# EAGLE design untitled (EAGLE 9.6.2)
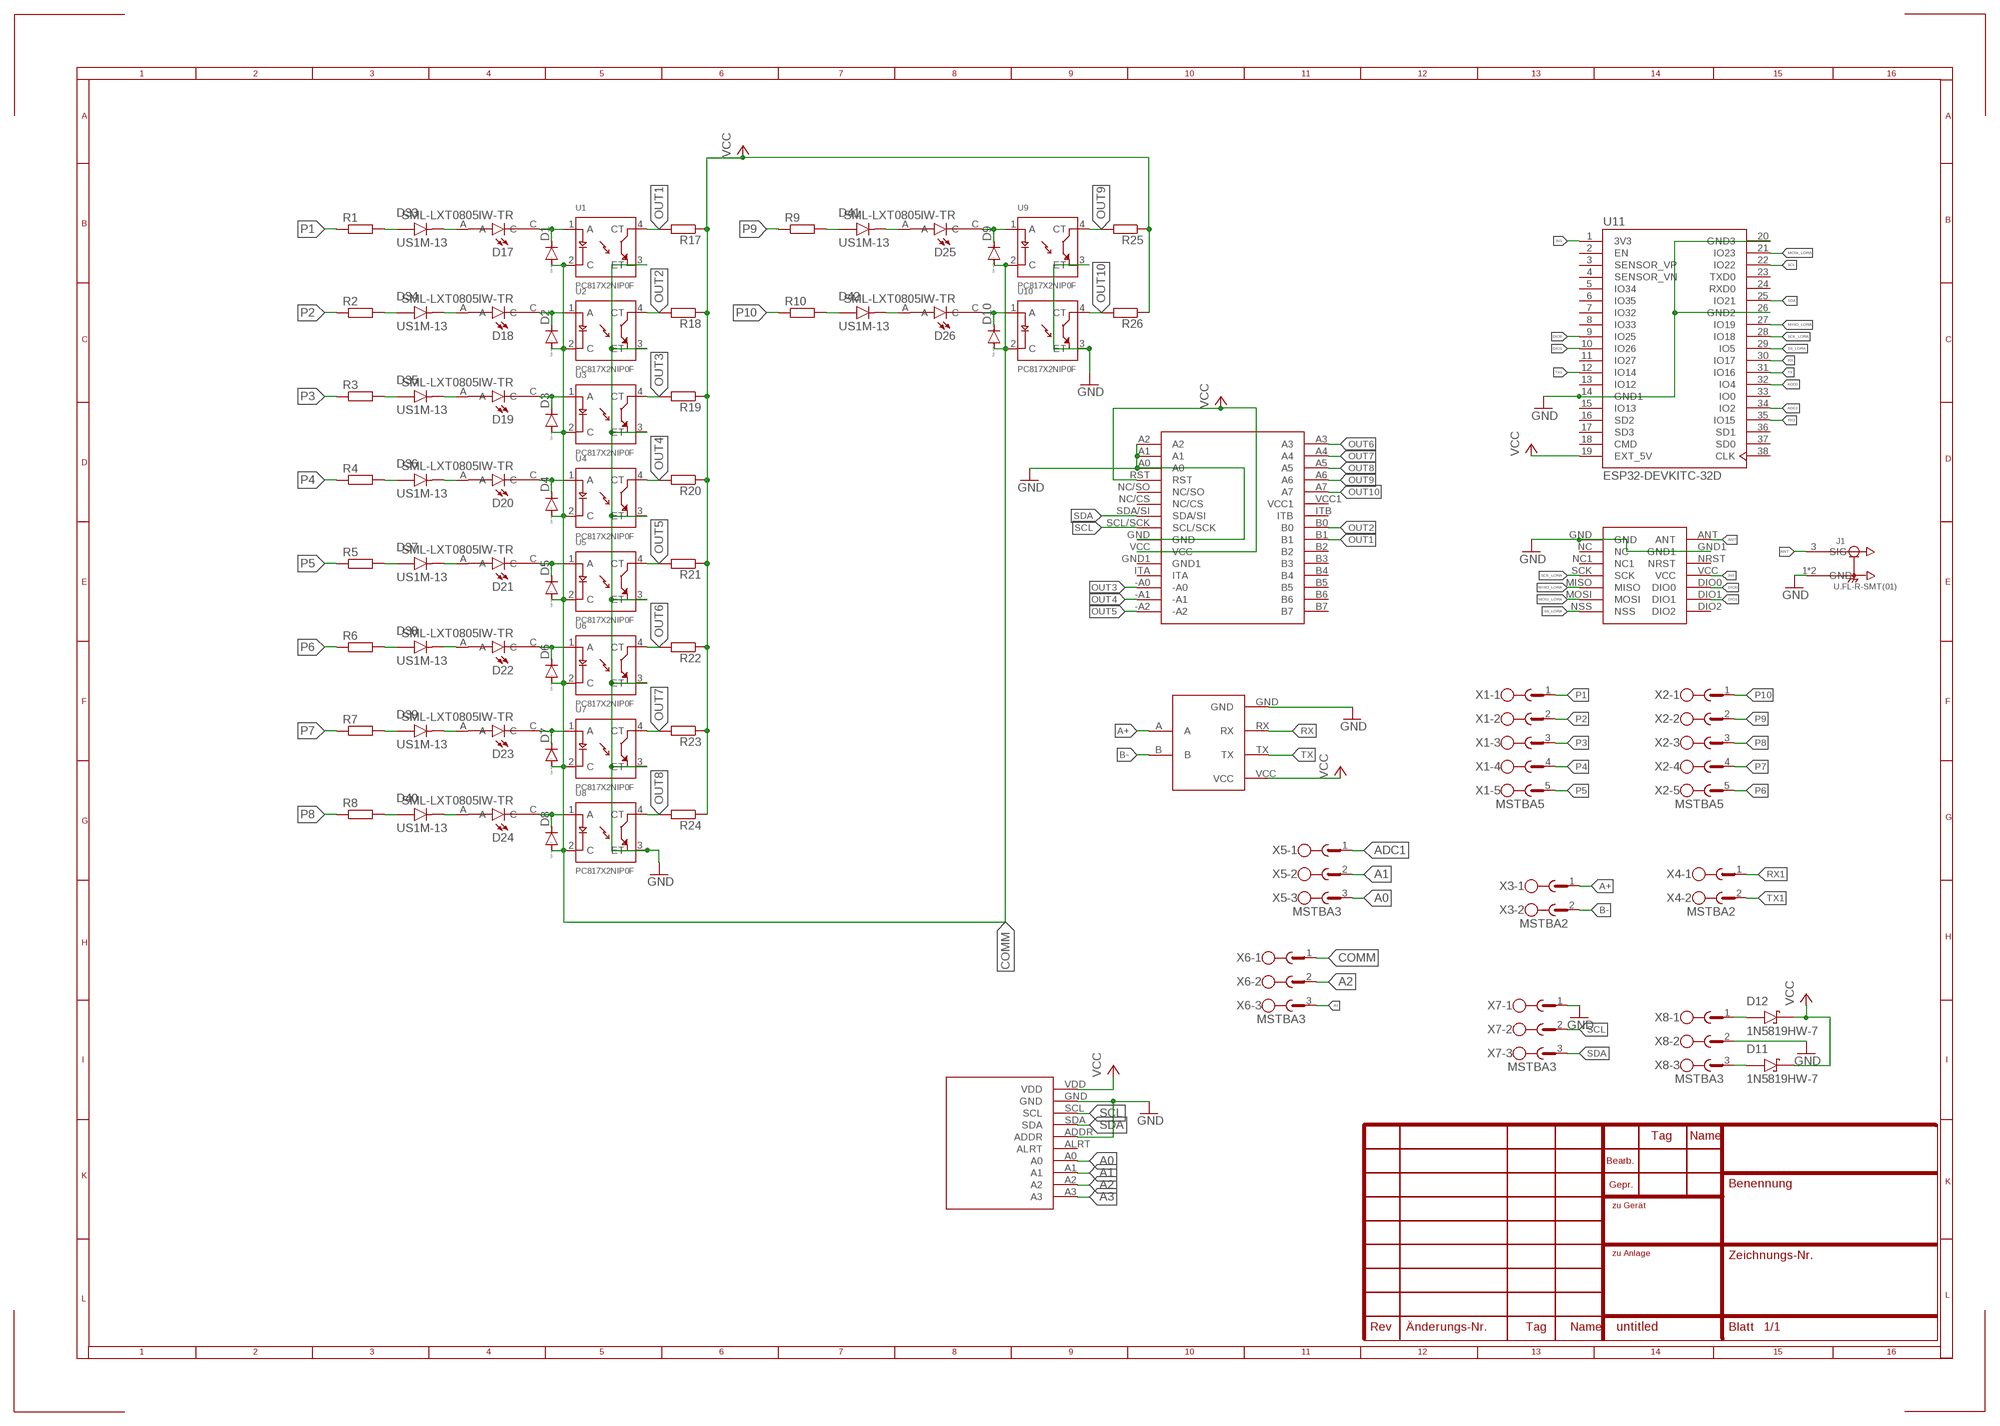
[diagram p0: schematic, sheet 1]

## Parts
ADS1  ADS1115  [ADS1115]
D1  DIODE-SOD123  [SOD123]
D2  DIODE-SOD123  [SOD123]
D3  DIODE-SOD123  [SOD123]
D4  DIODE-SOD123  [SOD123]
D5  DIODE-SOD123  [SOD123]
D6  DIODE-SOD123  [SOD123]
D7  DIODE-SOD123  [SOD123]
D8  DIODE-SOD123  [SOD123]
D9  DIODE-SOD123  [SOD123]
D10  DIODE-SOD123  [SOD123]
D11  1N5819HW-7  [SOD3715X145N]
D12  1N5819HW-7  [SOD3715X145N]
D17  SML-LXT0805IW-TR  [LEDC2012X120N]
D18  SML-LXT0805IW-TR  [LEDC2012X120N]
D19  SML-LXT0805IW-TR  [LEDC2012X120N]
D20  SML-LXT0805IW-TR  [LEDC2012X120N]
D21  SML-LXT0805IW-TR  [LEDC2012X120N]
D22  SML-LXT0805IW-TR  [LEDC2012X120N]
D23  SML-LXT0805IW-TR  [LEDC2012X120N]
D24  SML-LXT0805IW-TR  [LEDC2012X120N]
D25  SML-LXT0805IW-TR  [LEDC2012X120N]
D26  SML-LXT0805IW-TR  [LEDC2012X120N]
D33  US1M-13  [DIOM5226X240N]
D34  US1M-13  [DIOM5226X240N]
D35  US1M-13  [DIOM5226X240N]
D36  US1M-13  [DIOM5226X240N]
D37  US1M-13  [DIOM5226X240N]
D38  US1M-13  [DIOM5226X240N]
D39  US1M-13  [DIOM5226X240N]
D40  US1M-13  [DIOM5226X240N]
D41  US1M-13  [DIOM5226X240N]
D42  US1M-13  [DIOM5226X240N]
J1  U.FL-R-SMT(01)  [HRS_U.FL-R-SMT(01)]
LORA-NICERF-V1  LORA-NICERF-V2  [LORA-NICERF-V2]
MCP1  MCP23017  [MCP23017]
R1  R-EU_0414/15  [0414/15]
R2  R-EU_0414/15  [0414/15]
R3  R-EU_0414/15  [0414/15]
R4  R-EU_0414/15  [0414/15]
R5  R-EU_0414/15  [0414/15]
R6  R-EU_0414/15  [0414/15]
R7  R-EU_0414/15  [0414/15]
R8  R-EU_0414/15  [0414/15]
R9  R-EU_0414/15  [0414/15]
R10  R-EU_0414/15  [0414/15]
R17  R-EU_R0805  [R0805]
R18  R-EU_R0805  [R0805]
R19  R-EU_R0805  [R0805]
R20  R-EU_R0805  [R0805]
R21  R-EU_R0805  [R0805]
R22  R-EU_R0805  [R0805]
R23  R-EU_R0805  [R0805]
R24  R-EU_R0805  [R0805]
R25  R-EU_R0805  [R0805]
R26  R-EU_R0805  [R0805]
TTL-RS1  TTL-RS485  [TTL-RS485]
U1  PC817X2NIP0F  [SOT254P975X400-4N]
U2  PC817X2NIP0F  [SOT254P975X400-4N]
U3  PC817X2NIP0F  [SOT254P975X400-4N]
U4  PC817X2NIP0F  [SOT254P975X400-4N]
U5  PC817X2NIP0F  [SOT254P975X400-4N]
U6  PC817X2NIP0F  [SOT254P975X400-4N]
U7  PC817X2NIP0F  [SOT254P975X400-4N]
U8  PC817X2NIP0F  [SOT254P975X400-4N]
U9  PC817X2NIP0F  [SOT254P975X400-4N]
U10  PC817X2NIP0F  [SOT254P975X400-4N]
U11  ESP32-DEVKITC-32D  [MODULE_ESP32-DEVKITC-32D]
X1  MSTBA5  [MSTBA5]
X2  MSTBA5  [MSTBA5]
X3  MSTBA2  [MSTBA2]
X4  MSTBA2  [MSTBA2]
X5  MSTBA3  [MSTBA3]
X6  MSTBA3  [MSTBA3]
X7  MSTBA3  [MSTBA3]
X8  MSTBA3  [MSTBA3]

## Nets
3V3: LORA-NICERF-V1.VCC U11.1(3V3)
A0: ADS1.A0 X5.3
A1: ADS1.A1 X5.2
A2: ADS1.A2 X6.2
A3: ADS1.A3 X6.3
A+: TTL-RS1.A X3.1
ADC0: U11.32(IO4)
ADC1: U11.34(IO2) X5.1
ANT: J1.3(SIG) LORA-NICERF-V1.ANT
B-: TTL-RS1.B X3.2
COMM: D1.A D2.A D3.A D4.A D5.A D6.A D7.A D8.A D9.A D10.A U1.2(C) U2.2(C) U3.2(C) U4.2(C) U5.2(C) U6.2(C) U7.2(C) U8.2(C) U9.2(C) U10.2(C) X6.1
DIO0: LORA-NICERF-V1.DIO0 U11.9(IO25)
DIO1: LORA-NICERF-V1.DIO1 U11.10(IO26)
GND: ADS1.ADDR ADS1.GND J1.1(GND) J1.2(GND) LORA-NICERF-V1.GND LORA-NICERF-V1.GND1 MCP1.A0 MCP1.A1 MCP1.A2 MCP1.GND TTL-RS1.GND U1.3(ET) U2.3(ET) U3.3(ET) U4.3(ET) U5.3(ET) U6.3(ET) U7.3(ET) U8.3(ET) U9.3(ET) U10.3(ET) U11.14(GND1) U11.20(GND3) U11.26(GND2) X7.1 X8.2
MISO_LORA: LORA-NICERF-V1.MISO U11.27(IO19)
MOSI_LORA: LORA-NICERF-V1.MOSI U11.21(IO23)
N$1: D17.A D33.C(K)
N$2: D33.A R1.2
N$3: D1.C D17.C U1.1(A)
N$5: D34.A R2.2
N$6: D18.A D34.C(K)
N$7: D2.C D18.C U2.1(A)
N$8: D35.A R3.2
N$9: D19.A D35.C(K)
N$10: D3.C D19.C U3.1(A)
N$11: D36.A R4.2
N$12: D20.A D36.C(K)
N$13: D4.C D20.C U4.1(A)
N$15: D12.A X8.1
N$16: D11.A X8.3
N$17: D37.A R5.2
N$18: D21.A D37.C(K)
N$19: D5.C D21.C U5.1(A)
N$20: D38.A R6.2
N$21: D22.A D38.C(K)
N$22: D6.C D22.C U6.1(A)
N$25: D39.A R7.2
N$26: D23.A D39.C(K)
N$27: D7.C D23.C U7.1(A)
N$28: D40.A R8.2
N$29: D24.A D40.C(K)
N$30: D8.C D24.C U8.1(A)
N$33: D41.A R9.2
N$34: D25.A D41.C(K)
N$35: D9.C D25.C U9.1(A)
N$36: D42.A R10.2
N$37: D26.A D42.C(K)
N$38: D10.C D26.C U10.1(A)
OUT1: MCP1.B1 R17.2 U1.4(CT)
OUT2: MCP1.B0 R18.2 U2.4(CT)
OUT3: MCP1.-A0 R19.2 U3.4(CT)
OUT4: MCP1.-A1 R20.2 U4.4(CT)
OUT5: MCP1.-A2 R21.2 U5.4(CT)
OUT6: MCP1.A3 R22.2 U6.4(CT)
OUT7: MCP1.A4 R23.2 U7.4(CT)
OUT8: MCP1.A5 R24.2 U8.4(CT)
OUT9: MCP1.A6 R25.2 U9.4(CT)
OUT10: MCP1.A7 R26.2 U10.4(CT)
P1: R1.1 X1.1
P2: R2.1 X1.2
P3: R3.1 X1.3
P4: R4.1 X1.4
P5: R5.1 X1.5
P6: R6.1 X2.5
P7: R7.1 X2.4
P8: R8.1 X2.3
P9: R9.1 X2.2
P10: R10.1 X2.1
RX: TTL-RS1.RX U11.30(IO17)
RX1: U11.35(IO15) X4.1
SCK_LORA: LORA-NICERF-V1.SCK U11.28(IO18)
SCL: ADS1.SCL MCP1.SCL/SCK U11.22(IO22) X7.2
SDA: ADS1.SDA MCP1.SDA/SI U11.25(IO21) X7.3
SS_LORA: LORA-NICERF-V1.NSS U11.29(IO5)
TX: TTL-RS1.TX U11.31(IO16)
TX1: U11.12(IO14) X4.2
VCC: ADS1.VDD D11.C(K) D12.C(K) MCP1.RST MCP1.VCC R17.1 R18.1 R19.1 R20.1 R21.1 R22.1 R23.1 R24.1 R25.1 R26.1 TTL-RS1.VCC U11.19(EXT_5V)
Unconnected: ADS1.ALRT LORA-NICERF-V1.DIO2 LORA-NICERF-V1.NC LORA-NICERF-V1.NC1 LORA-NICERF-V1.NRST MCP1.B2 MCP1.B3 MCP1.B4 MCP1.B5 MCP1.B6 MCP1.B7 MCP1.GND1 MCP1.ITA MCP1.ITB MCP1.NC/CS MCP1.NC/SO MCP1.VCC1 U11.2(EN) U11.3(SENSOR_VP) U11.4(SENSOR_VN) U11.5(IO34) U11.6(IO35) U11.7(IO32) U11.8(IO33) U11.11(IO27) U11.13(IO12) U11.15(IO13) U11.16(SD2) U11.17(SD3) U11.18(CMD) U11.23(TXD0) U11.24(RXD0) U11.33(IO0) U11.36(SD1) U11.37(SD0) U11.38(CLK)

## Library data of the parts
ADS1 = ds1115:ADS1115
D1-D10 = diode:DIODE-: DIODE
D11 D12 = 1N5819HW-7:1N5819HW-7: 1N5819HW Series 40 V 1 A Surface Mount Schottky Barrier Rectifier - SOD-123 Check availability <https://pricing.snapeda.com/parts/1N5819HW-7/Diodes%20Inc./view-part?ref=eda>; AVAILABILITY: In Stock; DESCRIPTION: Diode Schottky 40 V 1A Surface Mount SOD-123; MF: Diodes Inc.; MP: 1N5819HW-7; PACKAGE: SOD-123 Fairchild Semiconductor; PRICE: None; PURCHASE-URL: https://pricing.snapeda.com/search/part/1N5819HW-7/?ref=eda
D17-D26 = SML-LXT0805IW-TR:SML-LXT0805IW-TR: LED; Luminous Intensity:11µcd; Viewing Angle:140°; Forward Current:30mA; Forward Voltage:2V; Color:Red; LED Color:Red; Leaded Process Compatible:Yes; Lens Color:White; Mounting Type:Surface Mount ;RoHS Compliant: Yes Check availability <https://pricing.snapeda.com/parts/SML-LXT0805IW-TR/Lumex%20Opto/Components/view-part?ref=eda>; AVAILABILITY: In Stock; DESCRIPTION: Red - LED Indication - Discrete 2V 0805 (2012 Metric); MF: Lumex Opto/Components; MP: SML-LXT0805IW-TR; PACKAGE: 0805 Lumex; PRICE: None; PURCHASE-URL: https://pricing.snapeda.com/search/part/SML-LXT0805IW-TR/?ref=eda
D33-D42 = US1M-13:US1M-13: Diode, Fast Recovery, 1a, 1kv, Do-214ac-2, Full Reel Check availability <https://pricing.snapeda.com/parts/US1M-13/Diodes%20Incorporated/view-part?ref=eda>; AVAILABILITY: In Stock; DESCRIPTION: Diode Standard 1000 V 1A Surface Mount SMA; MF: Diodes Incorporated; MP: US1M-13; PACKAGE: DO-214AC-214 Diodes Incorporated; PRICE: None; PURCHASE-URL: https://pricing.snapeda.com/search/part/US1M-13/?ref=eda
J1 = U.FL-R-SMT_01_:U.FL-R-SMT(01): U.FL Series 6 Ghz 50 Ohm Ultra-small SMT Coaxial Cable Receptacle Check availability <https://pricing.snapeda.com/parts/U.FL-R-SMT%2801%29/Hirose/view-part?ref=eda>; AVAILABILITY: In Stock; DESCRIPTION: U.FL (UMCC) Connector Receptacle, Male Pin 50Ohm Surface Mount Solder. RF Connectors / Coaxial Connectors; MF: Hirose; MP: U.FL-R-SMT(01); PACKAGE: None; PRICE: None; PURCHASE-URL: https://pricing.snapeda.com/search/part/U.FL-R-SMT(01)/?ref=eda
LORA-NICERF-V1 = LORA-NICERF-V2:LORA-NICERF-V2
MCP1 = mcp23017:MCP23017
R1-R10 R17-R26 = rcl:R-EU_: RESISTOR, European symbol; SPICEPREFIX: R
TTL-RS1 = TTL-RS485:TTL-RS485
U1-U10 = PC817X2NIP0F:PC817X2NIP0F: PC817 Series 1 Channel 80 V 5000 Vrms General Purpose Photocoupler - DIP-4 Check availability <https://pricing.snapeda.com/parts/PC817X2NIP0F/Sharp%20Microelectronics/view-part?ref=eda>; AVAILABILITY: Not in stock; DESCRIPTION: Optoisolator Transistor Output 5000Vrms 1 Channel 4-SMD; MF: Sharp Microelectronics; MP: PC817X2NIP0F; PACKAGE: SMD-4 Sharp Microelectronics; PRICE: None
U11 = ESP32-DEVKITC-32D:ESP32-DEVKITC-32D: Eval Board For Esp-Wroom-32 Check availability <https://pricing.snapeda.com/parts/ESP32-DEVKITC-32D/Espressif%20Systems/view-part?ref=eda>; AVAILABILITY: In Stock; DESCRIPTION: WiFi Development Tools (802.11) ESP32 General Development Kit, ESP32-WROOM-32D on the board; MF: Espressif Systems; MP: ESP32-DEVKITC-32D; PACKAGE: None; PRICE: None; PURCHASE-URL: https://pricing.snapeda.com/search/part/ESP32-DEVKITC-32D/?ref=eda
X1 X2 = con-phoenix-508:MSTBA5: PHOENIX; MPN: 1757271; OC_FARNELL: 3705201; OC_NEWARK: 71C4164
X3 X4 = con-phoenix-508:MSTBA2: PHOENIX; MF: FARNELL; MPN: 1757242; OC_FARNELL: 3705171; OC_NEWARK: 71C4161
X5-X8 = con-phoenix-508:MSTBA3: PHOENIX; MF: FARNELL; MPN: 1757255; OC_FARNELL: 3705183; OC_NEWARK: 71C4162

## Board
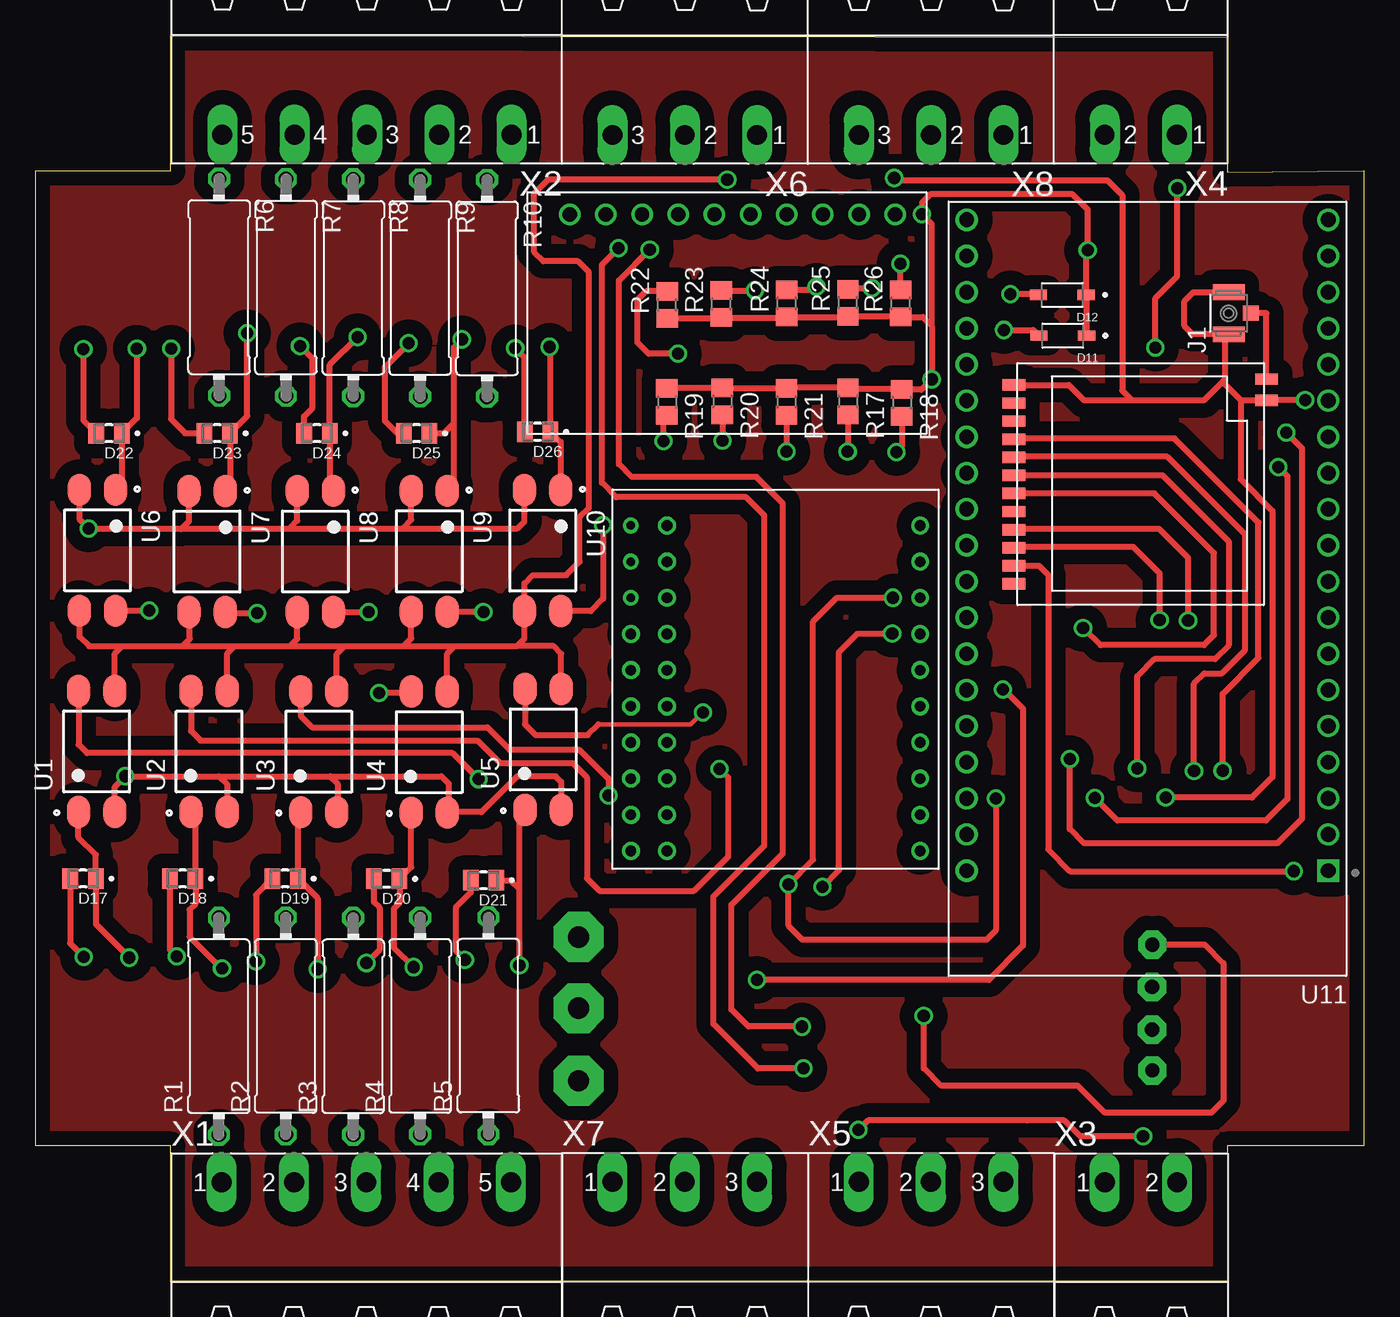
[diagram p1: board, top side]
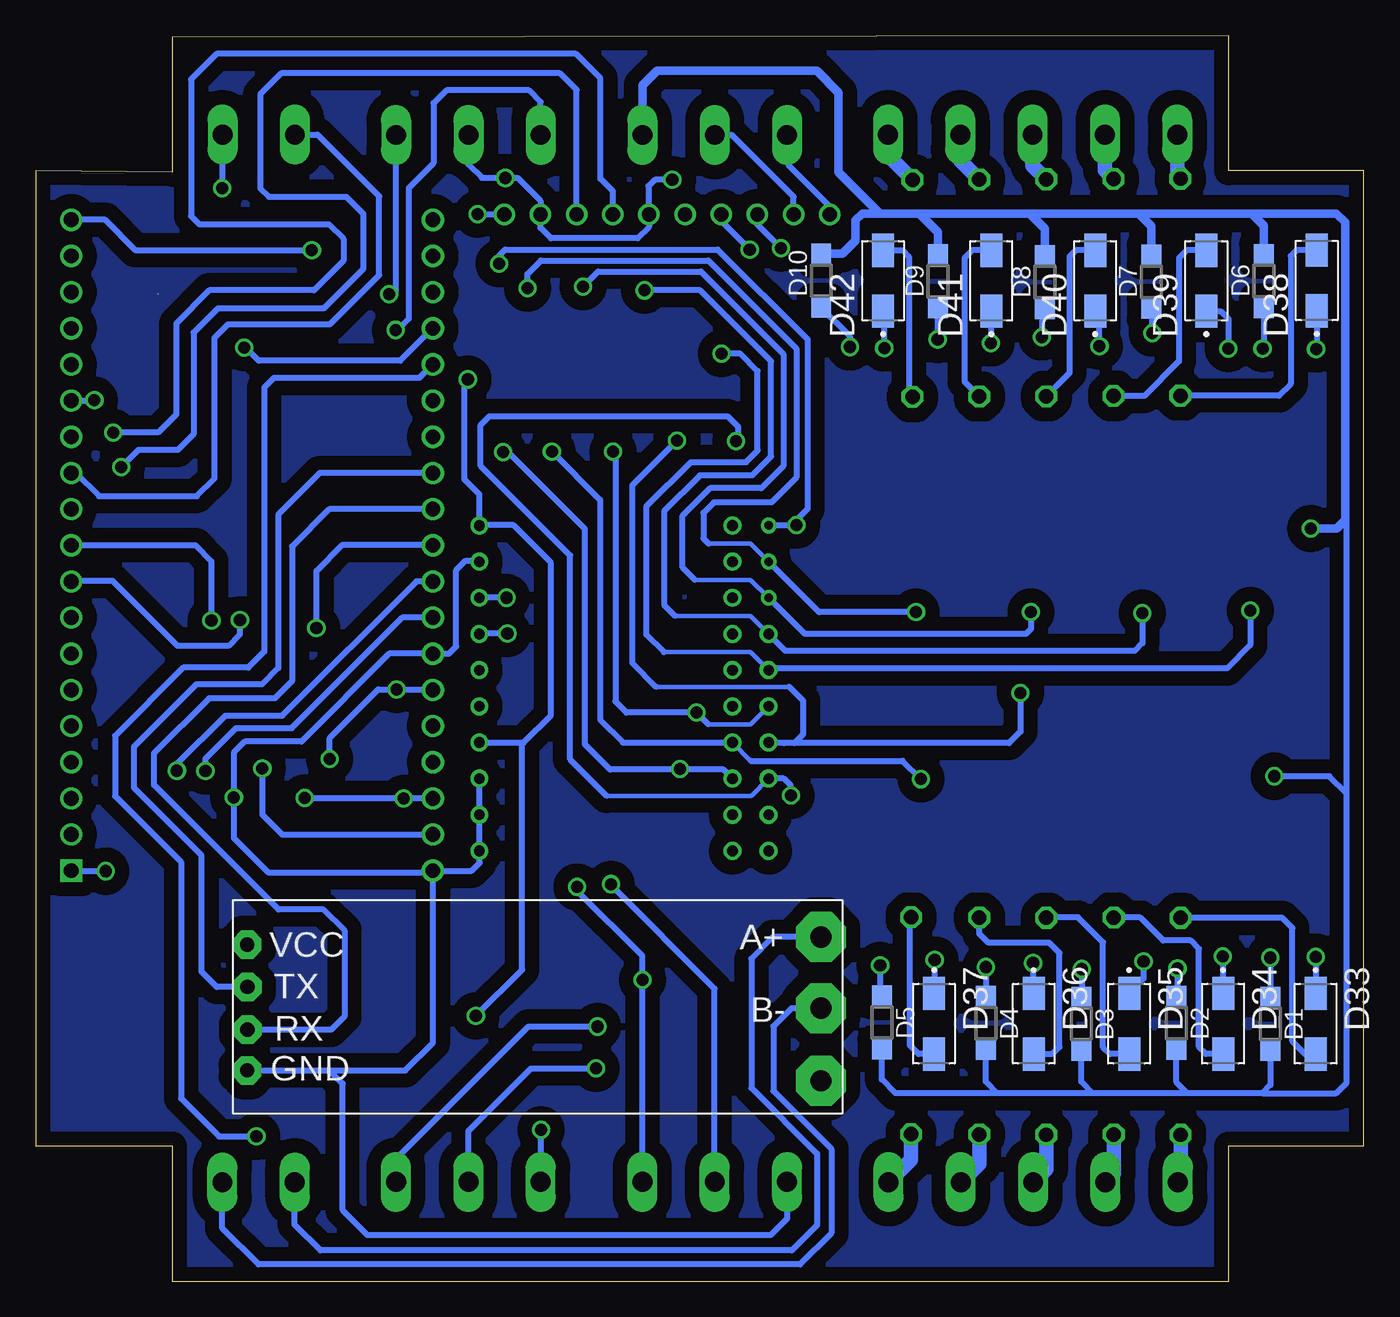
[diagram p2: board, bottom side, seen from below]

Size 93.3 x 87.5 mm. Coordinates in mm from the lower left corner, seen from the top.
Outline: 9.5,87.5 83.7,87.4 83.7,77.9 93.3,78 93.3,9.5 83.7,9.5 83.7,0 9.5,0 9.5,9.5 0,9.5 0,78 9.5,78 9.5,87.5
Copper layers (1*16): Top 0.035mm / dielectric 1.5mm / Bottom 0.035mm
Design rules "default": minimum track width 6mil, minimum drill 0.35mm, track to track 6mil, track to pad 6mil, pad to pad 6mil, via to via 6mil, smd to smd 6mil, copper to edge 40mil, drill to drill 6mil, minimum pad ring 10mil, minimum via ring 8mil, stop-mask expansion 4mil, vias tented up to drill 0mil, thermal gap 10mil

### Footprints (pad centres in the part's own frame; a part is rotated, then mirrored left to right if it is on the bottom)
ADS1115 = drill 1: A0 -6.35,-1.27; A1 -6.35,-3.81; A2 -6.35,-6.35; A3 -6.35,-8.89; ADDR -6.35,3.81; ALRT -6.35,1.27; GND -6.35,11.43; SCL -6.35,8.89; SDA -6.35,6.35; VDD -6.35,13.97
SOD123 = smd 1.4 x 1.4: A 1.9,0; C -1.9,0
SOD3715X145N = smd 1.21 x 0.73: A 1.68,0; C -1.68,0
LEDC2012X120N = smd 1.1 x 1.45: A 0.9,0; C -0.9,0
DIOM5226X240N = smd 2.33 x 1.55: A 2.135,0; C -2.135,0
HRS_U.FL-R-SMT(01) = smd 1.1 x 2.25: 1 -1.475,0; 2 1.475,0 | smd 1.05 x 1.1: 3 0,-1.55
LORA-NICERF-V2 = smd 1.6 x 0.8: ANT 9.17,6.81; DIO0 -8.57,-5.03; DIO1 -8.57,-3.76; DIO2 -8.57,-2.49; GND -8.57,6.4; GND1 9.17,5.31; MISO -8.57,1.32; MOSI -8.57,0.05; NC -8.57,5.13; NC1 -8.57,3.86; NRST -8.57,-7.57; NSS -8.57,-1.22; SCK -8.57,2.59; VCC -8.57,-6.3
MCP23017 = drill 0.75: -A0 11.43,6.35; -A1 11.43,3.81; -A2 11.43,1.27; A0 -8.89,6.35; A1 -8.89,8.89; A2 -8.89,11.43; A3 11.43,-1.27; A4 11.43,-3.81; B0 8.89,6.35; B1 8.89,3.81; B2 8.89,1.27; B3 8.89,-1.27; B4 8.89,-3.81; B5 8.89,-6.35; B6 8.89,-8.89; B7 8.89,-11.43; GND -8.89,-8.89; GND1 11.43,11.43; ITA 11.43,8.89; ITB 8.89,8.89; NC/CS -8.89,-1.27; NC/SO -8.89,1.27; RST -8.89,3.81; SCL/SCK -8.89,-6.35; SDA/SI -8.89,-3.81; VCC -8.89,-11.43; VCC1 8.89,11.43 | drill 0.6: A5 11.43,-6.35; A6 11.43,-8.89; A7 11.43,-11.43
0414/15 = drill 1.016 octagon: 1 -7.62,0; 2 7.62,0
R0805 = smd 1.3 x 1.5: 1 -0.95,0; 2 0.95,0
TTL-RS485 = drill 1.5 pad 3.5 octagon: A -19.7,-6; B -19.7,-1; P$7 -19.7,4.1 | drill 1 pad 2 octagon: GND 20.6,3.37; RX 20.581,0.505; TX 20.583,-2.493; VCC 20.6,-5.47
SOT254P975X400-4N = smd 2.25 x 1.6: 1 -4.25,1.27; 2 -4.25,-1.27; 3 4.25,-1.27; 4 4.25,1.27
MODULE_ESP32-DEVKITC-32D = drill 1.04 square: 1 -12.7,19.76 | drill 1.04: 2 -12.7,17.22; 3 -12.7,14.68; 4 -12.7,12.14; 5 -12.7,9.6; 6 -12.7,7.06; 7 -12.7,4.52; 8 -12.7,1.98; 9 -12.7,-0.56; 10 -12.7,-3.1; 11 -12.7,-5.64; 12 -12.7,-8.18; 13 -12.7,-10.72; 14 -12.7,-13.26; 15 -12.7,-15.8; 16 -12.7,-18.34; 17 -12.7,-20.88; 18 -12.7,-23.42; 19 -12.7,-25.96; 20 12.7,19.76; 21 12.7,17.22; 22 12.7,14.68; 23 12.7,12.14; 24 12.7,9.6; 25 12.7,7.06; 26 12.7,4.52; 27 12.7,1.98; 28 12.7,-0.56; 29 12.7,-3.1; 30 12.7,-5.64; 31 12.7,-8.18; 32 12.7,-10.72; 33 12.7,-13.26; 34 12.7,-15.8; 35 12.7,-18.34; 36 12.7,-20.88; 37 12.7,-23.42; 38 12.7,-25.96
MSTBA5 = drill 1.397 long: 1 -10.16,5.08; 2 -5.08,5.08; 3 0,5.08; 4 5.08,5.08; 5 10.16,5.08
MSTBA2 = drill 1.397 long: 1 -2.54,5.08; 2 2.54,5.08
MSTBA3 = drill 1.397 long: 1 -5.08,5.08; 2 0,5.08; 3 5.08,5.08

### Placement (x,y rotation side)
ADS1  46.41,68.59 270 top
D1  6.56,18.09 270 bottom
D2  13.16,18.14 270 bottom
D3  19.86,18.09 270 bottom
D4  26.56,18.14 270 bottom
D5  33.86,18.19 270 bottom
D6  7.04,70.26 90 bottom
D7  14.94,70.21 90 bottom
D8  22.42,70.19 90 bottom
D9  29.92,70.24 90 bottom
D10  38.12,70.29 90 bottom
D11  72.15,66.43 180 top
D12  72.11,69.28 180 top
D17  3.33,28.29 180 top
D18  10.33,28.29 180 top
D19  17.53,28.29 180 top
D20  24.66,28.27 180 top
D21  31.46,28.17 180 top
D22  5.16,59.57 180 top
D23  12.76,59.57 180 top
D24  19.76,59.57 180 top
D25  26.76,59.57 180 top
D26  35.26,59.67 180 top
D33  3.39,18.1 270 bottom
D34  9.89,18.1 270 bottom
D35  16.49,18.1 270 bottom
D36  23.19,18.1 270 bottom
D37  30.19,18.1 270 bottom
D38  3.31,70.3 90 bottom
D39  11.07,70.28 90 bottom
D40  18.87,70.28 90 bottom
D41  26.17,70.28 90 bottom
D42  33.77,70.28 90 bottom
J1  83.8,68 90 top
LORA-NICERF-V1  77.29,56.56 0 top
MCP1  53.24,41.66 180 top
R1  12.87,17.91 90 top
R2  17.57,17.93 90 top
R3  22.31,17.91 90 top
R4  27.01,17.93 90 top
R5  31.81,17.95 90 top
R6  12.89,69.83 270 top
R7  17.59,69.81 270 top
R8  22.31,69.79 270 top
R9  27.01,69.77 270 top
R10  31.71,69.75 270 top
R17  57.06,61.81 270 top
R18  60.84,61.71 270 top
R19  44.34,61.76 270 top
R20  48.24,61.81 270 top
R21  52.74,61.76 270 top
R22  44.36,68.59 90 top
R23  48.16,68.64 90 top
R24  52.76,68.69 90 top
R25  57.06,68.74 90 top
R26  60.76,68.69 90 top
TTL-RS1  57.84,18.18 180 bottom
U1  4.29,37.22 90 top
U2  12.19,37.21 90 top
U3  19.89,37.2 90 top
U4  27.65,37.17 90 top
U5  35.65,37.36 90 top
U6  4.35,51.35 270 top
U7  12.05,51.26 270 top
U8  19.65,51.27 270 top
U9  27.65,51.28 270 top
U10  35.61,51.33 270 top
U11  78.1,48.6 180 top
X1  23.23,1.88 0 top
X2  23.27,85.63 180 top
X3  77.64,1.87 0 top
X4  77.63,85.63 180 top
X5  62.9,1.9 0 top
X6  45.6,85.6 180 top
X7  45.6,1.9 0 top
X8  62.9,85.6 180 top

### Tracks (layer width: path | path; a pad name or v marks a point on that pad's centre or on a via)
3V3  (via drill 0.85)
  Top 0.406: LORA-NICERF-V1.VCC 70.47,50.26 71.13,49.6 71.13,30.34 72.66,28.81 v88.38,28.81
  Bottom 0.406: U11.1 88.42,28.84 v88.38,28.81
A0  (via drill 0.85)
  Top 0.406: v53.83,17.89 50.08,17.89 48.88,19.09 48.88,26.44 52.49,30.05 52.49,54.64 50.64,56.5 41.86,56.5 40.96,57.39 40.96,70.3 v43.14,72.47
  Bottom 0.406: X5.3 67.98,8.59 58.68,17.89 v53.83,17.89 | v43.14,72.47 45.14,74.47 ADS1.A0
A1  (via drill 0.85)
  Top 0.406: v53.93,14.95 50.73,14.95 47.61,18.07 47.61,27.02 51.19,30.6 51.19,53.8 49.91,55.09 40.78,55.09 39.77,56.09 39.77,71.4 v40.94,72.56
  Bottom 0.406: X5.2 62.9,10.56 58.51,14.95 v53.93,14.95 | v40.94,72.56 42.6,74.22 ADS1.A1
A2
  Bottom 0.406: ADS1.A2 40.06,76.18 44.4,80.52 X6.2
A3
  Bottom 0.406: ADS1.A3 37.52,75.49 40.42,78.39 40.42,80.42 X6.3
A+
  Bottom 0.406: TTL-RS1.A 41.49,24.18 43.03,22.65 43.03,13.57 38.41,8.96 38.41,3.94 40.19,2.16 73.29,2.16 75.11,3.98 X3.1
ADC1  (via drill 0.85)
  Top 0.406: v77.79,10.18 73.39,10.18 72.26,11.31 69.64,11.31 | 69.64,11.31 69.6,11.34 | 69.64,11.31 58.47,11.31 v57.81,10.65
  Bottom 0.406: U11.34 66.36,63.44 76.57,63.44 77.23,62.78 77.23,44.23 78.37,43.1 82.92,43.1 87.71,38.31 87.71,34.08 83.08,29.46 83.08,12.85 80.42,10.18 v77.79,10.18 | v57.81,10.65 57.82,10.63 X5.1
ANT
  Top 0.406: LORA-NICERF-V1.ANT 86.46,68 J1.3
B-
  Bottom 0.406: TTL-RS1.B 40.21,19.18 41.47,17.91 41.47,13.37 37.41,9.31 37.41,3.38 39.61,1.19 77.65,1.19 80.18,3.72 X3.2
COMM  (via drill 0.85)
  Top 0.406: U6.2 3.08,53.54 v3.74,52.88 3.79,52.84 10.22,52.84 10.27,52.88 | U7.2 10.78,53.4 10.27,52.88 | 10.27,52.88 17.84,52.88 | U8.2 18.38,53.42 17.84,52.88 | 17.84,52.88 25.77,52.88 | U9.2 26.38,53.49 25.77,52.88 | 25.77,52.88 33.84,52.88 34.34,53.38 U10.2 | U1.2 5.56,34.74 v6.3,35.48 12.87,35.48 | U2.2 13.46,34.89 12.87,35.48 | 12.87,35.48 20.7,35.48 | 20.7,35.48 21.2,34.98 21.2,32.99 U3.2 | 20.7,35.48 28.51,35.48 29.02,34.97 29.02,33.02 | 29.02,33.02 U4.2 | U5.2 36.92,35.09 36.53,35.48 33.83,35.48 31.32,32.97 29.07,32.97 29.02,33.02
  Bottom 0.406: D1.A 6.56,13.8 7.14,13.22 | 7.14,13.22 12.41,13.22 | 12.41,13.22 13.16,13.97 D2.A | 12.41,13.22 19.05,13.22 | D3.A 19.86,14.03 19.05,13.22 | 19.05,13.22 25.75,13.22 | D4.A 26.56,14.03 25.75,13.22 | 25.75,13.22 32.91,13.22 33.86,14.18 D5.A | 7.14,13.22 1.95,13.22 1.22,13.95 1.22,34.27 | v6.3,35.48 v6.29,35.47 2.42,35.47 1.22,34.27 | 1.22,34.27 1.22,53.36 1.32,53.46
  Bottom 0.61: X6.1 50.68,84.01 49.65,85.04 38.43,85.04 36.89,83.5 36.89,77.9 33.99,75 | 33.99,75 31.22,75 | D9.A 29.92,73.7 31.22,75 | D10.A 36.63,72.19 35.7,73.11 35.7,74.52 35.23,75 33.99,75 | 31.22,75 23.48,75 | D8.A 22.42,73.94 23.48,75 | 23.48,75 15.82,75 | D7.A 14.94,74.12 15.82,75 | 15.82,75 7.88,75 | D6.A 7.04,74.16 7.88,75 | 7.88,75 1.94,75 1.32,74.38 1.32,53.46 1.91,52.87 3.67,52.87 3.7,52.9 3.72,52.9 v3.74,52.88
DIO0  (via drill 0.85)
  Top 0.406: v78.95,46.44 78.95,49.73 77.1,51.58 68.77,51.58 LORA-NICERF-V1.DIO0
  Bottom 0.406: v78.95,46.44 78.95,45.44 79.75,44.63 83.32,44.63 87.89,49.2 90.76,49.2 U11.9
DIO1  (via drill 0.85)
  Top 0.406: v80.95,46.42 80.95,50.81 78.92,52.84 68.76,52.84 LORA-NICERF-V1.DIO1
  Bottom 0.406: U11.10 82.07,51.7 80.95,50.58 v80.95,46.42
GND  (via drill 0.85)
  Top 0.406: U6.3 3.08,45.28 3.75,44.61 6.08,44.61 | 6.08,44.61 10.32,44.61 | 10.32,44.61 10.84,45.12 10.84,46.95 U7.3 | U1.3 5.56,44.09 6.08,44.61 | 10.32,44.61 13.97,44.61 | 13.97,44.61 17.86,44.61 | U8.3 18.38,45.13 17.86,44.61 | 17.86,44.61 21.7,44.61 | 21.7,44.61 25.84,44.61 | U9.3 26.38,45.16 25.84,44.61 | 25.84,44.61 29.43,44.61 | 29.43,44.61 33.82,44.61 | 33.82,44.61 34.34,45.13 U10.3 34.34,49.02 34.92,49.6 37.27,49.6 38.22,50.56 38.22,53.67 38.87,54.31 38.87,70.87 38.09,71.64 35.67,71.64 35.02,72.29 35.02,76.38 36.04,77.4 48.55,77.4 v48.58,77.37 | U2.3 13.46,44.1 13.97,44.61 | U3.3 21.16,44.08 21.7,44.61 | U4.3 28.92,44.1 29.43,44.61 | U5.3 36.92,44.08 36.38,44.61 33.82,44.61 | J1.1 83.55,66.53 | 83.55,66.53 81.26,66.53 80.69,67.09 80.69,68.86 81.31,69.47 J1.2 | 84.64,61.87 LORA-NICERF-V1.GND1 86.5,61.91 v89.17,61.91 | 83.55,63.38 83.55,62.99 84.64,61.91 84.64,61.87 | 83.55,63.38 83.55,66.53 | 77.04,61.87 82.05,61.87 83.55,63.38 | 77.04,61.87 73.65,61.87 72.56,62.96 LORA-NICERF-V1.GND | 84.64,61.87 84.64,56.34 86.87,54.11 86.87,35.42 85.43,33.98 v79.38,33.98 79.34,33.98 | v60.31,77.5 60.73,77.5 60.9,77.33 75.31,77.33 76.33,76.31 76.33,62.58 77.04,61.87
  Bottom 0.406: X8.2 62.9,78.45 61.95,77.5 v60.31,77.5 59.45,77.5 57.84,75.89 ADS1.GND 57.84,73.99 57.11,73.26 51.01,73.26 50.22,74.06 ADS1.ADDR 50.25,74.97 50.25,76.93 49.81,77.37 v48.58,77.37 | TTL-RS1.GND 72.67,14.81 | 72.67,14.81 67.34,14.81 65.39,16.76 65.39,28.73 | 65.39,28.73 U11.20 62.67,28.84 62.1,29.4 62.1,30.2 MCP1.A2 MCP1.A1 MCP1.A0 | X7.1 40.52,4.4 41.67,3.25 69.98,3.25 71.73,5 71.73,13.88 72.67,14.81 | 65.39,28.73 76.97,28.73 79.38,31.14 v79.38,33.98 79.38,37.14 78.6,37.91 74.62,37.91 68.45,44.08 U11.26 64.27,44.08 63.76,44.59 63.76,49.94 63.08,50.62 62.2,50.62 MCP1.GND | U11.14 89.22,61.86 v89.17,61.91
MISO_LORA  (via drill 0.85)
  Top 0.406: v81.37,35.85 81.37,41.98 82.1,42.71 83.33,42.71 84.92,44.3 84.92,52.48 79.48,57.92 68.76,57.92 LORA-NICERF-V1.MISO
  Bottom 0.406: U11.27 67.54,46.62 75.31,38.85 79.22,38.85 81.37,36.71 v81.37,35.85
MOSI_LORA  (via drill 0.85)
  Top 0.406: v77.37,36.03 77.37,42.49 78.58,43.7 82.83,43.7 83.8,44.67 83.8,51.97 79.17,56.61 LORA-NICERF-V1.MOSI
  Bottom 0.406: U11.21 75.97,31.38 77.37,32.78 v77.37,36.03
N$1  (via drill 0.85)
  Top 0.406: D17.A 2.43,23.74 v3.38,22.8
  Bottom 0.406: v3.38,22.8 3.38,20.86 3.24,20.72 3.24,20.38 D33.C
N$2
  Bottom 0.406: R1.2 12.86,25.54 5.75,25.54 5.03,24.82 5.03,16.86 4.14,15.96 D33.A
N$3  (via drill 0.85)
  Top 0.406: v6.59,22.73 4.23,25.09 D17.C 4.23,29.97 3.01,31.19 3.01,32.96 U1.1
  Bottom 0.406: v6.59,22.73 6.59,20.02 D1.C
N$4
  pour Bottom (isolate 1.016): 0,78 9.5,78 9.5,87.5 83.7,87.5 83.7,78 93.3,78 93.3,9.5 83.7,9.5 83.7,0 9.5,0 9.5,9.5 0,9.5
N$5
  Bottom 0.406: D34.A 11.07,15.96 11.59,16.48 11.59,23.36 12.17,23.93 14.1,23.93 15.72,25.55 R2.2
N$6  (via drill 0.85)
  Top 0.406: D18.A 9.43,23.3 v9.91,22.82
  Bottom 0.406: v9.91,22.82 9.91,20.85 9.89,20.83 D34.C
N$7  (via drill 0.85)
  Top 0.406: v13.09,21.98 13.05,21.98 10.82,24.21 10.82,26.11 11.23,26.53 D18.C 11.23,32.65 U2.1
  Bottom 0.406: v13.09,21.98 13.09,20.11 D2.C
N$8
  Bottom 0.406: D35.A 17.84,15.96 18.32,16.44 18.32,23.81 20.09,25.58 22.26,25.58 R3.2
N$9  (via drill 0.85)
  Top 0.406: D19.A 15.47,27.14 v15.47,22.47
  Bottom 0.406: v15.47,22.47 15.47,21.25 D35.C
N$10  (via drill 0.85)
  Top 0.406: v19.8,21.93 19.8,26.92 D19.C 18.43,32.76 U3.1
  Bottom 0.406: v19.8,21.93 19.8,20.05 D3.C
N$11
  Bottom 0.406: D36.A 21.88,15.96 21.38,16.46 21.38,23.06 22.09,23.77 26.37,23.77 27.01,24.41 R4.2
N$12  (via drill 0.85)
  Top 0.406: D20.A 23.76,26.64 24.16,26.25 24.16,23.27 v23.23,22.35
  Bottom 0.406: v23.23,22.35 23.23,20.28 D36.C
N$13  (via drill 0.85)
  Top 0.406: v26.55,22.07 26.54,22.05 25.15,23.43 25.15,26.17 25.56,26.58 D20.C 26.38,29.09 U4.1
  Bottom 0.406: v26.55,22.07 D4.C
N$14
  pour Top (isolate 1.016): 0,78 9.5,78 9.5,87.5 83.7,87.5 83.7,78 93.3,78 93.3,9.5 83.7,9.5 83.7,0 9.5,0 9.5,9.5 0,9.5
N$15  (via drill 0.85)
  Top 0.406: D12.A 70.43,69.34 v68.46,69.34
  Bottom 0.406: v68.46,69.34 68.14,69.34 68.02,69.47 68.02,80.41 67.98,80.44 X8.1
N$16  (via drill 0.85)
  Top 0.406: v68.02,66.83 70.07,66.83 D11.A
  Bottom 0.406: X8.3 57.82,82.82 58.66,83.66 64.44,83.66 65.35,82.75 65.35,78.55 67.09,76.8 67.09,67.61 67.88,66.83 v68.02,66.83
N$17
  Bottom 0.406: D37.A 31.28,15.96 31.9,16.58 31.9,25.48 R5.2
N$18  (via drill 0.85)
  Top 0.406: D21.A 30.56,27.3 29.51,26.25 29.51,23.24 30.16,22.58 v30.15,22.57
  Bottom 0.406: v30.15,22.57 30.15,20.27 D37.C
N$19  (via drill 0.85)
  Top 0.406: D21.C 33.33,28.17 33.98,27.52 | v33.98,22.2 33.98,27.52 | 33.98,27.52 33.98,32.71 U5.1
  Bottom 0.406: v33.98,22.2 33.98,20.21 D5.C
N$20
  Bottom 0.406: D38.A 4.72,72.44 5.14,72.01 5.14,63.03 5.96,62.21 R6.2
N$21  (via drill 0.85)
  Top 0.406: v3.36,65.49 3.36,60.47 D22.A
  Bottom 0.406: D38.C 3.31,65.53 v3.36,65.49
N$22  (via drill 0.85)
  Top 0.406: v7.12,65.5 7.12,60.62 D22.C 6.06,56.04 U6.1
  Bottom 0.406: D6.C 7.04,65.58 v7.12,65.5
N$25
  Bottom 0.406: D39.A 12.45,72.42 13,71.87 13,64.62 15.43,62.19 R7.2
N$26  (via drill 0.85)
  Top 0.406: v9.51,65.5 9.51,60.56 10.51,59.57 D23.A
  Bottom 0.406: D39.C 10.05,68.14 9.51,67.61 v9.51,65.5
N$27  (via drill 0.85)
  Top 0.406: v14.87,66.59 14.87,60.78 D23.C 13.66,55.85 U7.1
  Bottom 0.406: v14.87,66.59 14.87,68.24 D7.C
N$28
  Bottom 0.406: D40.A 20.24,72.42 20.67,71.98 20.67,63.81 R8.2
N$29  (via drill 0.85)
  Top 0.406: D24.A 18.86,60.75 19.45,61.34 19.45,64.8 v18.57,65.69
  Bottom 0.406: v18.57,65.69 18.57,67.84 D40.C
N$30  (via drill 0.85)
  Top 0.406: v22.61,66.33 20.66,64.38 D24.C 20.66,55.78 U8.1
  Bottom 0.406: D8.C 22.61,68.09 v22.61,66.33
N$33
  Bottom 0.406: D41.A 27.51,72.42 28.05,71.88 28.05,63.19 R9.2
N$34  (via drill 0.85)
  Top 0.406: D25.A 25.4,59.57 24.55,60.42 24.55,64.22 26.21,65.88 | 26.21,65.88 | 26.21,65.88 v26.2,65.89
  Bottom 0.406: v26.2,65.89 26.17,65.92 D41.C
N$35  (via drill 0.85)
  Top 0.406: D25.C 28.69,59.57 29.36,60.24 | 29.36,60.24 29.36,65.59 v29.94,66.17 | 29.36,60.24 29.36,55.97 U9.1
  Bottom 0.406: v29.94,66.17 29.92,66.18 D9.C
N$36
  Bottom 0.406: D42.A 32.4,72.42 31.96,71.98 31.96,62.38 R10.2
N$37  (via drill 0.85)
  Top 0.406: D26.A 34.36,64.88 v33.69,65.55
  Bottom 0.406: v33.69,65.55 33.69,68.07 D42.C
N$38  (via drill 0.85)
  Top 0.406: v36.11,65.63 36.16,65.58 D26.C 36.88,58.95 U10.1
  Bottom 0.406: D10.C 36.11,66.38 v36.11,65.63
OUT1  (via drill 0.85)
  Top 0.406: R17.2 57.06,58.34 57.08,58.33 v57.04,58.28 | U1.4 3.02,37.69 3.61,37.1 29.28,37.1 v31.11,35.27
  Bottom 0.305: 43.08,36.56 MCP1.B1
  Bottom 0.406: v57.04,58.28 53.64,54.89 53.64,39.43 52.05,37.84 MCP1.B1 | 43.08,36.56 32.41,36.56 v31.11,35.27
OUT2  (via drill 0.85)
  Top 0.406: R18.2 60.84,58.62 v60.48,58.26 | U2.4 10.92,38.65 11.59,37.98 31.04,37.98 32.61,36.4 37.72,36.4 38.72,35.4 38.72,28.3 39.6,27.42 46.24,27.42 48.65,29.84 48.65,35.38 v48.05,35.99
  Bottom 0.406: v60.48,58.26 60.12,58.26 54.73,52.86 54.73,37.73 52.94,35.94 48,35.94 | MCP1.B0 44.98,35.94 48,35.94 | v48.05,35.99 48,35.94
OUT3  (via drill 0.85)
  Top 0.406: v44.11,59.02 44.11,60.58 R19.2 | U3.4 18.62,39.7 19.41,38.9 31.74,38.9 33.28,37.36 38.16,37.36 40.25,35.27 v40.25,34.13
  Bottom 0.305: MCP1.-A0 43.02,34.1 53.19,34.1
  Bottom 0.406: 53.19,34.1 55.75,36.66 55.75,50.98 62.04,57.28 62.04,60.16 61.43,60.77 44.71,60.77 43.96,60.02 43.96,59.19 43.95,59.18 v44.11,59.02 | MCP1.-A0 40.74,35.31 40.25,34.81 v40.25,34.13
OUT4  (via drill 0.85)
  Top 0.406: R20.2 v48.24,59.05 v48.25,59.05 | U4.4 26.29,41.33 v24.13,41.33
  Bottom 0.305: 49.71,41.76 40.36,41.76
  Bottom 0.406: v48.25,59.05 51.41,55.9 51.41,43.45 49.71,41.76 | 40.36,41.76 39.4,40.79 39.4,38.42 40.01,37.81 | 40.01,37.81 40.7,37.81 41.77,37.81 MCP1.-A1 | v24.13,41.33 24.13,38.61 24.92,37.81 40.01,37.81
OUT5  (via drill 0.85)
  Top 0.305: 39.53,39.12 46.02,39.12 46.87,39.97 v46.88,39.96 v46.88,39.95
  Top 0.406: R21.2 v52.74,58.29 52.69,58.24 | U5.4 34.38,39.12 35.12,38.38 38.79,38.38 39.53,39.12
  Bottom 0.305: 46.05,39.12 43.08,39.12 MCP1.-A2
  Bottom 0.406: v52.74,58.29 52.58,58.13 52.58,40.73 51.8,39.95 v46.88,39.95 46.05,39.12
OUT6  (via drill 0.85)
  Top 0.406: v45.13,65.16 43.06,65.16 42.26,65.96 42.26,68.91 42.89,69.54 R22.2 | U6.4 7.95,47.1 v7.98,47.13
  Bottom 0.305: 49.17,44.19 43.07,44.19 MCP1.A3
  Bottom 0.406: 49.17,44.19 50.41,45.43 50.41,54.41 47.28,57.54 43.4,57.54 42.58,58.36 42.58,63.95 43.79,65.16 v45.13,65.16 | v7.98,47.13 7.98,44.69 9.61,43.06 41.68,43.06 MCP1.A3
OUT7  (via drill 0.85)
  Top 0.406: v50.52,69.61 50.51,69.59 R23.2 | U7.4 13.4,46.93 v15.56,46.93
  Bottom 0.305: 48.37,46.73 43.07,46.73 MCP1.A4
  Bottom 0.406: 48.37,46.73 49.14,47.5 49.14,54.1 46.65,56.6 42.98,56.6 41.63,57.94 41.63,64.63 46.62,69.61 v50.52,69.61 | v15.56,46.93 15.56,44.83 16.1,44.29 40.63,44.29 MCP1.A4
OUT8  (via drill 0.85)
  Top 0.406: v54.84,69.86 54.62,69.64 R24.2 | U8.4 23.36,47.02 23.37,47.03 v23.39,47
  Bottom 0.305: 47,49.27 43.08,49.27 41.84,48.04 MCP1.A5
  Bottom 0.406: v54.84,69.86 53.78,70.92 46.57,70.92 40.77,65.12 40.77,57.26 42.32,55.71 45.92,55.71 47.86,53.78 47.86,50.14 47,49.27 | v23.39,47 23.39,45.82 23.74,45.47 39.27,45.47 41.84,48.04
OUT9  (via drill 0.85)
  Top 0.406: R25.2 57.13,69.76 v58.75,69.76 | U9.4 31.42,47.03 v31.45,47
  Bottom 0.305: 46.03,51.82 43.08,51.82 MCP1.A6
  Bottom 0.406: v58.75,69.76 58.75,70.76 57.81,71.7 46.04,71.7 39.86,65.52 39.86,56.47 41.61,54.71 45.66,54.71 46.4,53.98 46.4,52.19 46.03,51.82 | v31.45,47 38.26,47 MCP1.A6
OUT10  (via drill 0.85)
  Top 0.406: R26.2 v60.76,71.48 | v39.87,53.11 39.87,47.95 39,47.08 U10.4
  Bottom 0.406: v60.76,71.48 60.76,72.04 60.32,72.47 45.39,72.47 39.08,66.17 39.08,54.25 40.24,53.09 | 40.24,53.09 MCP1.A7 | v39.87,53.11 39.89,53.09 40.24,53.09
P1
  Bottom 1.016: X1.1 12.87,7.16 R1.1
P2
  Bottom 1.016: X1.2 17.57,7.54 R2.1
P3
  Bottom 1.016: X1.3 22.31,7.88 R3.1
P4
  Bottom 1.016: X1.4 27.01,8.26 R4.1
P5
  Bottom 1.016: X1.5 31.81,8.54 R5.1
P6
  Bottom 1.016: R6.1 13.11,77.67 X2.5
P7
  Bottom 1.016: R7.1 18.19,78.03 X2.4
P8
  Bottom 1.016: R8.1 23.27,78.37 X2.3
P9
  Bottom 1.016: R9.1 28.35,78.73 X2.2
P10
  Bottom 1.016: R10.1 33.43,79.09 X2.1
RX
  Bottom 0.406: U11.30 72.68,54.24 75.3,51.62 75.3,42.16 76.5,40.95 81.12,40.95 84.97,37.1 84.97,34.86 76.24,26.12 73.09,26.12 71.61,24.64 71.61,18.61 72.54,17.68 TTL-RS1.RX
RX1  (via drill 0.85)
  Top 0.406: v78.65,65.58 78.65,69.07 80.19,70.61 v80.19,76.78
  Bottom 0.406: v80.19,76.78 80.17,76.8 X4.1 | U11.35 67.68,64.66 77.62,64.66 78.63,65.67 78.65,65.65 v78.65,65.58
SCK_LORA  (via drill 0.85)
  Top 0.406: LORA-NICERF-V1.SCK 68.76,59.2 80,59.2 85.9,53.3 85.9,43.79 83.38,41.27 v83.38,35.86
  Bottom 0.406: U11.28 66.55,49.16 75.97,39.74 79.96,39.74 83.38,36.33 v83.38,35.86
SCL  (via drill 0.85)
  Top 0.406: v60.22,48.02 56.3,48.02 54.62,46.33 54.62,29.62 v52.88,27.89 52.88,24.96 53.86,23.99 66.8,23.99 67.44,24.64 v67.44,33.92 | v87.28,57.19 87.93,56.55 87.93,33.88 86.41,32.36 75.99,32.36 v74.4,33.95
  Bottom 0.406: X7.2 45.6,20.55 52.88,27.83 v52.88,27.89 | v60.22,48.02 MCP1.SCL/SCK | U11.22 v67.44,33.92 67.47,33.95 v74.4,33.95 | ADS1.SCL 55.3,83.69 56.46,84.85 76.04,84.85 77.51,83.38 77.51,76.76 76.92,76.18 71.49,76.18 70.29,74.98 70.29,71.11 73.06,68.33 80.51,68.33 82.2,66.64 82.2,59.5 83.31,58.4 86.08,58.4 v87.28,57.19
SDA  (via drill 0.85)
  Top 0.406: v55.27,27.71 56.44,28.89 56.44,44.21 57.73,45.5 v60.17,45.5 | v67.95,41.58 68.01,41.58 69.36,40.23 69.36,23.59 66.95,21.17 v50.68,21.17 | v87.85,59.62 88.95,58.52 88.95,32.49 87.23,30.77 73.65,30.77 72.65,31.77 v72.65,36.68
  Bottom 0.406: X7.3 v50.68,21.17 50.68,22.85 55.27,27.44 v55.27,27.71 | v60.17,45.5 62.1,45.5 MCP1.SDA/SI | U11.25 67.91,41.54 v67.95,41.58 69.23,41.58 72.65,38.16 v72.65,36.68 | ADS1.SDA 52.76,76.58 53.62,77.45 53.62,84.5 55.34,86.22 80.59,86.22 82.38,84.43 82.38,74.82 81.81,74.25 72.71,74.25 71.68,73.22 71.68,71.68 73.75,69.61 81.09,69.61 83.42,67.28 83.42,60.89 84.69,59.62 v87.85,59.62
SS_LORA  (via drill 0.85)
  Top 0.406: v73.58,45.89 73.61,45.89 74.82,44.68 82.06,44.68 82.77,45.39 82.77,51.16 78.59,55.34 LORA-NICERF-V1.NSS
  Bottom 0.406: U11.29 71.77,51.7 73.58,49.9 v73.58,45.89
TX
  Bottom 0.406: U11.31 73.33,56.78 76.26,53.85 76.26,43.06 77.39,41.93 82.01,41.93 86.39,37.55 86.39,34.66 81.64,29.9 81.64,21.73 80.58,20.67 TTL-RS1.TX
TX1
  Bottom 0.406: U11.12 90.47,56.78 88.84,55.15 81.97,55.15 80.73,56.4 80.73,66.28 79.78,67.23 72.62,67.23 69.16,70.69 69.16,76.22 73.49,80.55 X4.2
VCC  (via drill 0.85)
  Top 0.406: R22.1 48.11,67.64 R23.1 52.71,67.69 R24.1 57.01,67.74 R25.1 60.71,67.79 R26.1 62.3,67.74 62.94,67.11 | R19.1 44.39,62.76 R20.1 48.29,62.71 R21.1 52.79,62.76 R17.1 57.16,62.66 60.25,62.66 | R18.1 60.25,62.66 | 62.94,67.11 v62.94,63.36 62.21,62.63 60.29,62.63 60.25,62.66 | 62.94,67.11 62.94,74.27 v62.26,74.94 62.26,75.77 62.84,76.35 72.83,76.35 73.9,75.28 v73.9,72.42 73.79,72.31 D12.C 73.83,69.25 D11.C | TTL-RS1.VCC 82.12,23.65 83.44,22.33 83.44,12.68 82.59,11.84 75.11,11.84 73.21,13.74 63.59,13.74 62.38,14.96 v62.38,18.64
  Bottom 0.406: v73.9,72.42 73.92,72.44 86.3,72.44 88.42,74.56 U11.19 | v62.26,74.94 ADS1.VDD | MCP1.RST 62.12,37.84 59.12,37.84 | 59.12,37.84 59.02,37.84 57.1,39.75 57.1,50.47 59.74,53.11 62.11,53.11 MCP1.VCC 62.13,55.27 63.19,56.33 63.19,62.91 62.8,63.3 62.85,63.36 v62.94,63.36 | v62.38,18.64 59.12,21.89 59.12,37.84